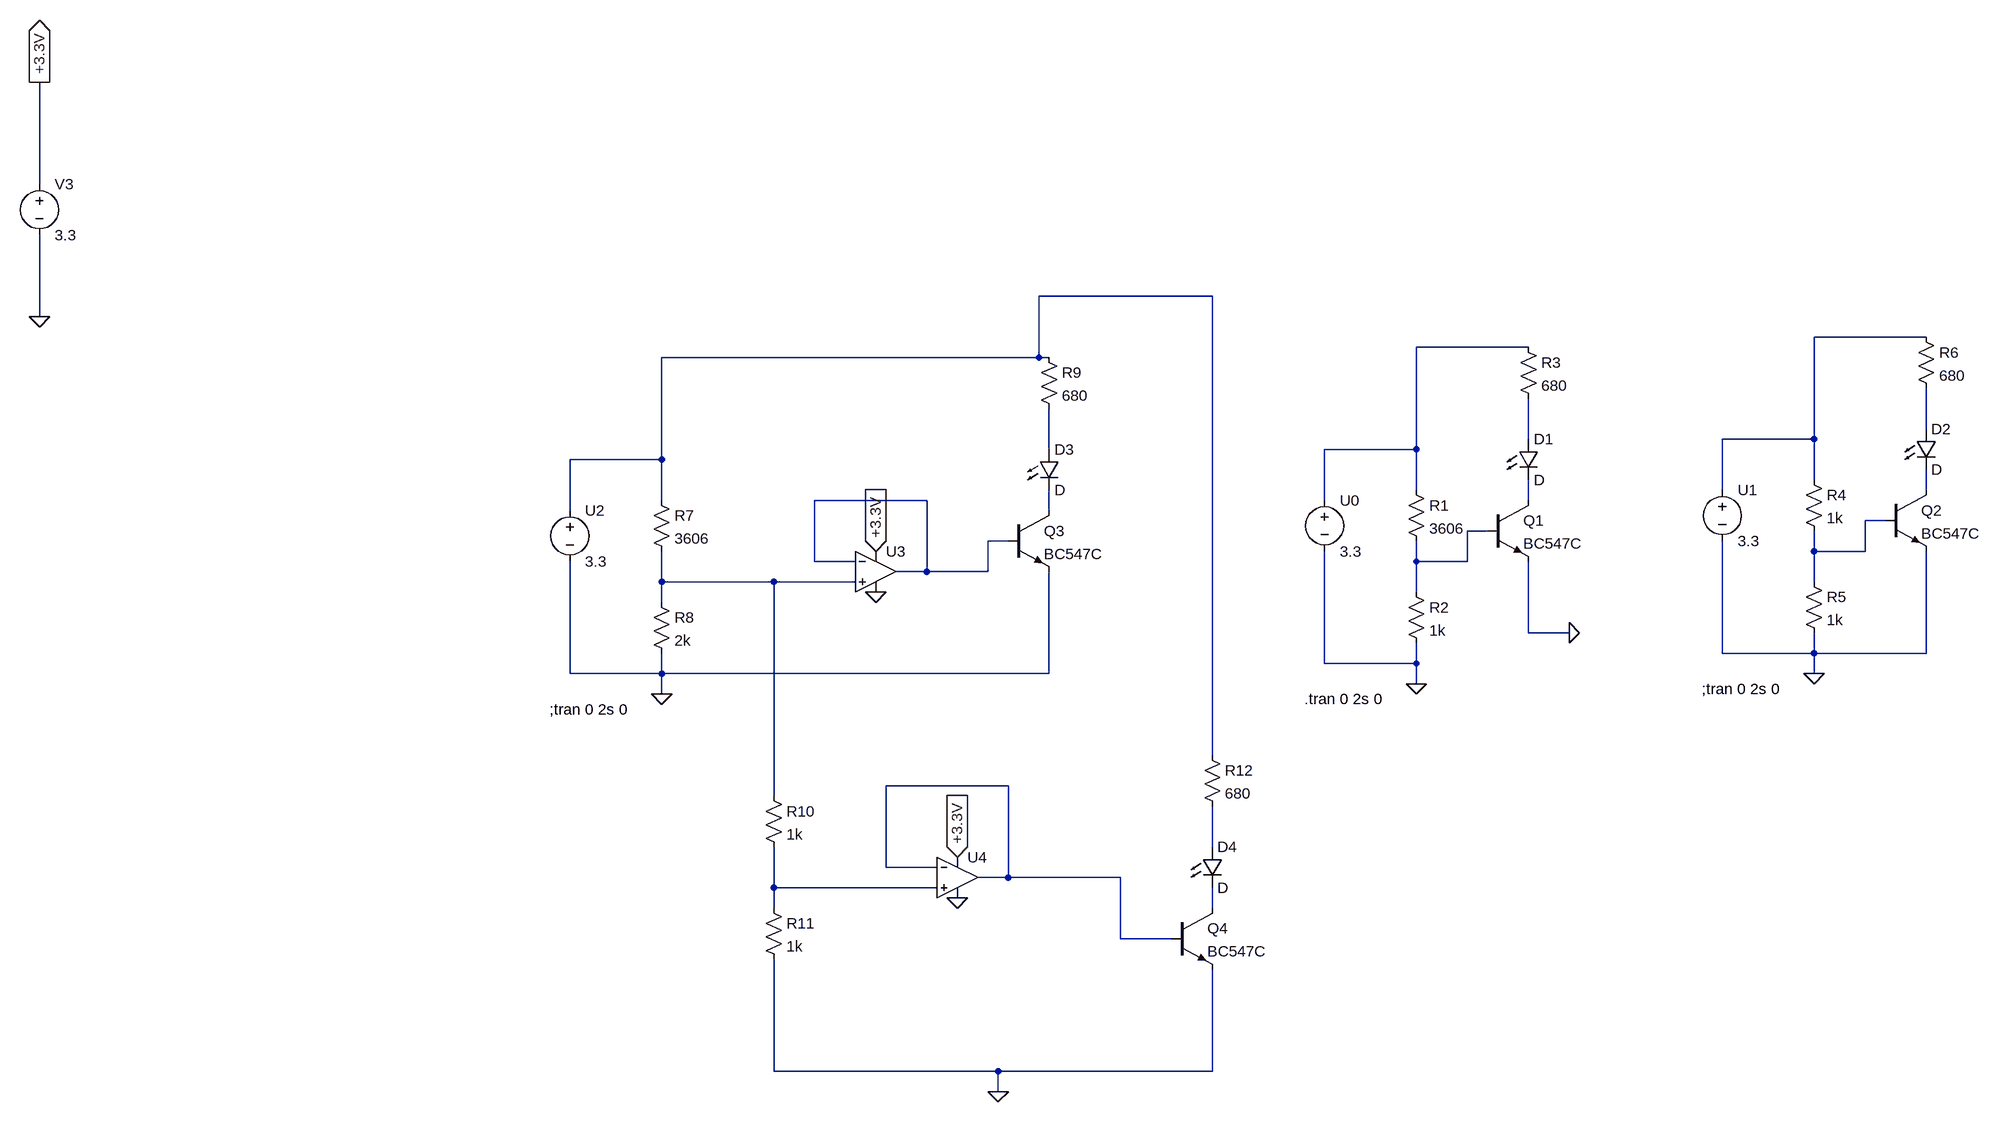
[diagram p0: schematic NTC.asc]
NTC.asc, the LTspice schematic file:
Version 4
SHEET 1 1900 1092
WIRE -2096 -352 -2096 -512
WIRE -256 -176 -528 -176
WIRE -2096 -144 -2096 -272
WIRE 864 -112 688 -112
WIRE 240 -96 64 -96
WIRE -528 -80 -528 -176
WIRE -528 -80 -1120 -80
WIRE -512 -80 -528 -80
WIRE 864 32 864 -32
WIRE 240 48 240 -16
WIRE 688 48 688 -112
WIRE 688 48 544 48
WIRE -512 64 -512 0
WIRE 64 64 64 -96
WIRE 64 64 -80 64
WIRE -1120 80 -1120 -80
WIRE -1120 80 -1264 80
WIRE 688 112 688 48
WIRE 64 128 64 64
WIRE 544 128 544 48
WIRE 864 128 864 96
WIRE -1120 144 -1120 80
WIRE -704 144 -880 144
WIRE -80 144 -80 64
WIRE 240 144 240 112
WIRE -1264 160 -1264 80
WIRE -512 160 -512 128
WIRE 800 176 768 176
WIRE 176 192 144 192
WIRE -576 208 -608 208
WIRE 688 224 688 192
WIRE 768 224 768 176
WIRE 768 224 688 224
WIRE -880 240 -880 144
WIRE -816 240 -880 240
WIRE 64 240 64 208
WIRE 144 240 144 192
WIRE 144 240 64 240
WIRE -704 256 -704 144
WIRE -704 256 -752 256
WIRE -608 256 -608 208
WIRE -608 256 -704 256
WIRE -1120 272 -1120 224
WIRE -944 272 -1120 272
WIRE -816 272 -944 272
WIRE 688 272 688 224
WIRE 64 288 64 240
WIRE -1120 304 -1120 272
WIRE 240 352 240 240
WIRE 304 352 240 352
WIRE 544 384 544 208
WIRE 688 384 688 352
WIRE 688 384 544 384
WIRE 864 384 864 224
WIRE 864 384 688 384
WIRE -80 400 -80 224
WIRE 64 400 64 368
WIRE 64 400 -80 400
WIRE -1264 416 -1264 240
WIRE -1120 416 -1120 384
WIRE -1120 416 -1264 416
WIRE -512 416 -512 256
WIRE -512 416 -1120 416
WIRE 688 416 688 384
WIRE 64 432 64 400
WIRE -1120 448 -1120 416
WIRE -256 544 -256 -176
WIRE -576 592 -768 592
WIRE -944 608 -944 272
WIRE -256 688 -256 624
WIRE -768 720 -768 592
WIRE -688 720 -768 720
WIRE -576 736 -576 592
WIRE -576 736 -624 736
WIRE -400 736 -576 736
WIRE -944 752 -944 688
WIRE -688 752 -944 752
WIRE -944 784 -944 752
WIRE -256 784 -256 752
WIRE -400 832 -400 736
WIRE -320 832 -400 832
WIRE -944 1040 -944 864
WIRE -592 1040 -944 1040
WIRE -256 1040 -256 880
WIRE -256 1040 -592 1040
WIRE -592 1072 -592 1040
FLAG 64 432 0
FLAG 688 416 0
FLAG -1120 448 0
FLAG -2096 -512 +3.3V
IOPIN -2096 -512 Out
FLAG -2096 -144 0
FLAG -784 224 +3.3V
IOPIN -784 224 In
FLAG -784 288 0
FLAG -656 704 +3.3V
IOPIN -656 704 In
FLAG -656 768 0
FLAG -592 1072 0
FLAG 304 352 0
SYMBOL npn 176 144 R0
SYMATTR InstName Q1
SYMATTR Value BC547C
SYMBOL voltage -80 128 R0
WINDOW 123 0 0 Left 0
WINDOW 39 0 0 Left 0
SYMATTR InstName U0
SYMATTR Value 3.3
SYMBOL res 48 112 R0
SYMATTR InstName R1
SYMATTR Value 3606
SYMBOL res 48 272 R0
SYMATTR InstName R2
SYMATTR Value 1k
SYMBOL LED 224 48 R0
SYMATTR InstName D1
SYMBOL res 224 -112 R0
SYMATTR InstName R3
SYMATTR Value 680
SYMBOL npn 800 128 R0
SYMATTR InstName Q2
SYMATTR Value BC547C
SYMBOL voltage 544 112 R0
WINDOW 123 0 0 Left 0
WINDOW 39 0 0 Left 0
SYMATTR InstName U1
SYMATTR Value 3.3
SYMBOL res 672 96 R0
SYMATTR InstName R4
SYMATTR Value 1k
SYMBOL res 672 256 R0
SYMATTR InstName R5
SYMATTR Value 1k
SYMBOL LED 848 32 R0
SYMATTR InstName D2
SYMBOL res 848 -128 R0
SYMATTR InstName R6
SYMATTR Value 680
SYMBOL npn -576 160 R0
SYMATTR InstName Q3
SYMATTR Value BC547C
SYMBOL voltage -1264 144 R0
WINDOW 123 0 0 Left 0
WINDOW 39 0 0 Left 0
SYMATTR InstName U2
SYMATTR Value 3.3
SYMBOL res -1136 128 R0
SYMATTR InstName R7
SYMATTR Value 3606
SYMBOL res -1136 288 R0
SYMATTR InstName R8
SYMATTR Value 2k
SYMBOL LED -528 64 R0
SYMATTR InstName D3
SYMBOL res -528 -96 R0
SYMATTR InstName R9
SYMATTR Value 680
SYMBOL OpAmps\\UniversalOpamp -784 256 R0
SYMATTR InstName U3
SYMBOL voltage -2096 -368 R0
WINDOW 123 0 0 Left 0
WINDOW 39 0 0 Left 0
SYMATTR InstName V3
SYMATTR Value 3.3
SYMBOL res -960 592 R0
SYMATTR InstName R10
SYMATTR Value 1k
SYMBOL res -960 768 R0
SYMATTR InstName R11
SYMATTR Value 1k
SYMBOL OpAmps\\UniversalOpamp -656 736 R0
SYMATTR InstName U4
SYMBOL npn -320 784 R0
SYMATTR InstName Q4
SYMATTR Value BC547C
SYMBOL LED -272 688 R0
SYMATTR InstName D4
SYMBOL res -272 528 R0
SYMATTR InstName R12
SYMATTR Value 680
TEXT -112 456 Left 2 !.tran 0 2s 0
TEXT 512 440 Left 2 !;tran 0 2s 0
TEXT -1296 472 Left 2 !;tran 0 2s 0

The netlist it stands for:
* NTC.asc
Q1 N009 N012 0 0 BC547C
V§U0 N003 0 3.3
R1 N003 N012 3606
R2 N012 0 1k
D1 N005 N009 D
R3 N003 N005 680
Q2 N007 N011 0 0 BC547C
V§U1 N002 0 3.3
R4 N002 N011 1k
R5 N011 0 1k
D2 N004 N007 D
R6 N002 N004 680
Q3 N010 N008 0 0 BC547C
V§U2 N001 0 3.3
R7 N001 N013 3606
R8 N013 0 2k
D3 N006 N010 D
R9 N001 N006 680
XU3 N013 N008 +3.3V 0 N008 level1 Avol=1Meg GBW=10Meg Vos=0 En=0 Enk=0 In=0 Ink=0 Rin=500Meg  ; pins In+ In- V+ V- OUT
V3 +3.3V 0 3.3
R10 N013 N016 1k
R11 N016 0 1k
XU4 N016 N014 +3.3V 0 N014 level1 Avol=1Meg GBW=10Meg Vos=0 En=0 Enk=0 In=0 Ink=0 Rin=500Meg  ; pins In+ In- V+ V- OUT
Q4 N017 N014 0 0 BC547C
D4 N015 N017 D
R12 N001 N015 680
.model D D
.lib standard.dio
.model NPN NPN
.model PNP PNP
.lib standard.bjt
.tran 0 2s 0
;tran 0 2s 0
;tran 0 2s 0
.lib UniversalOpAmp1.lib
.backanno
.end